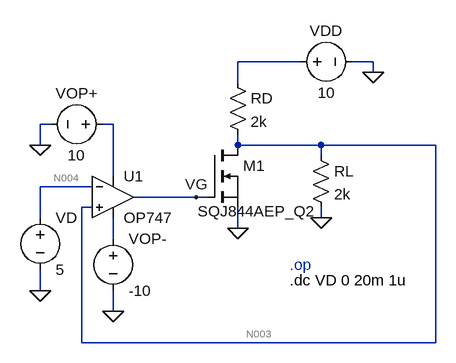
[diagram p0: schematic mos_vs_vds.asc]
mos_vs_vds.asc, the LTspice schematic file:
Version 4.1
SHEET 1 880 680
WIRE 304 -16 208 -16
WIRE 416 -16 384 -16
WIRE 416 0 416 -16
WIRE 208 16 208 -16
WIRE -80 80 -96 80
WIRE 16 80 0 80
WIRE -96 112 -96 80
WIRE 208 112 208 96
WIRE 336 112 208 112
WIRE 512 112 336 112
WIRE 336 128 336 112
WIRE 16 160 16 80
WIRE -16 176 -96 176
WIRE 144 192 48 192
WIRE 160 192 144 192
WIRE -16 208 -32 208
WIRE -96 224 -96 176
WIRE 336 224 336 208
WIRE 208 240 208 208
WIRE 16 256 16 224
WIRE -96 336 -96 304
WIRE 16 368 16 336
WIRE -32 416 -32 208
WIRE 512 416 512 112
WIRE 512 416 -32 416
FLAG 416 0 0
FLAG 336 224 0
FLAG 208 240 0
FLAG 144 192 VG
FLAG -96 336 0
FLAG -96 112 0
FLAG 16 368 0
SYMBOL nmos 160 112 R0
WINDOW 3 -14 102 Left 2
SYMATTR InstName M1
SYMATTR Value SQJ844AEP_Q2
SYMBOL res 192 0 R0
SYMATTR InstName RD
SYMATTR Value 2k
SYMBOL voltage 288 -16 R270
WINDOW 0 32 56 VTop 2
WINDOW 3 -32 56 VBottom 2
WINDOW 123 0 0 Left 0
WINDOW 39 0 0 Left 0
SYMATTR InstName VDD
SYMATTR Value 10
SYMBOL res 320 112 R0
SYMATTR InstName RL
SYMATTR Value 2k
SYMBOL OpAmps\\OP747 16 128 R0
SYMATTR InstName U1
SYMBOL voltage -96 208 R0
WINDOW 123 0 0 Left 0
WINDOW 39 0 0 Left 0
SYMATTR InstName VD
SYMATTR Value 5
SYMBOL voltage 16 80 R90
WINDOW 0 -32 56 VBottom 2
WINDOW 3 32 56 VTop 2
WINDOW 123 0 0 Left 0
WINDOW 39 0 0 Left 0
SYMATTR InstName VOP+
SYMATTR Value 10
SYMBOL voltage 16 240 R0
WINDOW 123 0 0 Left 0
WINDOW 39 0 0 Left 0
SYMATTR InstName VOP-
SYMATTR Value -10
TEXT 288 296 Left 2 ;.op
TEXT 288 320 Left 2 !.dc VD 0 20m 1u

The netlist it stands for:
* mos_vs_vds.asc
M1 N003 VG 0 0 SQJ844AEP_Q2
RD N001 N003 2k
VDD N001 0 10
RL N003 0 2k
X§U1 N003 N004 N002 N005 VG OP747  ; pins In+ In- V+ V- OUT
VD N004 0 5
VOP+ N002 0 10
VOP- N005 0 -10
.model NMOS NMOS
.model PMOS PMOS
.lib standard.mos
* .op
.dc VD 0 20m 1u
.backanno
.end

* Results of the author's LTspice run, read from the files saved beside the schematic
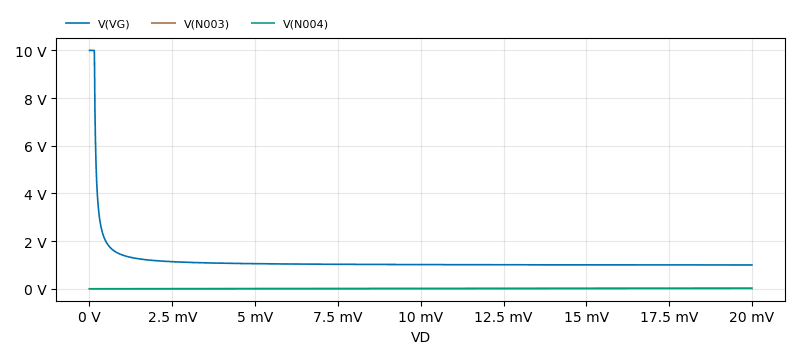
[diagram p1: DC transfer characteristic of mos_vs_vds.asc, plotted from the saved traces]
* DC transfer characteristic, 1 run:
*   V(VG): 10 V at VD=0 V, 999.8 mV at VD=20 mV, min 999.8 mV, max 10 V
*   V(N003): 68.88 µV at VD=0 V, 19.92 mV at VD=20 mV, min 68.88 µV, max 19.92 mV
*   V(N004): 0 V at VD=0 V, 20 mV at VD=20 mV, min 0 V, max 20 mV